# Altium project HEPA_CONTROL_PCB.PrjPcb
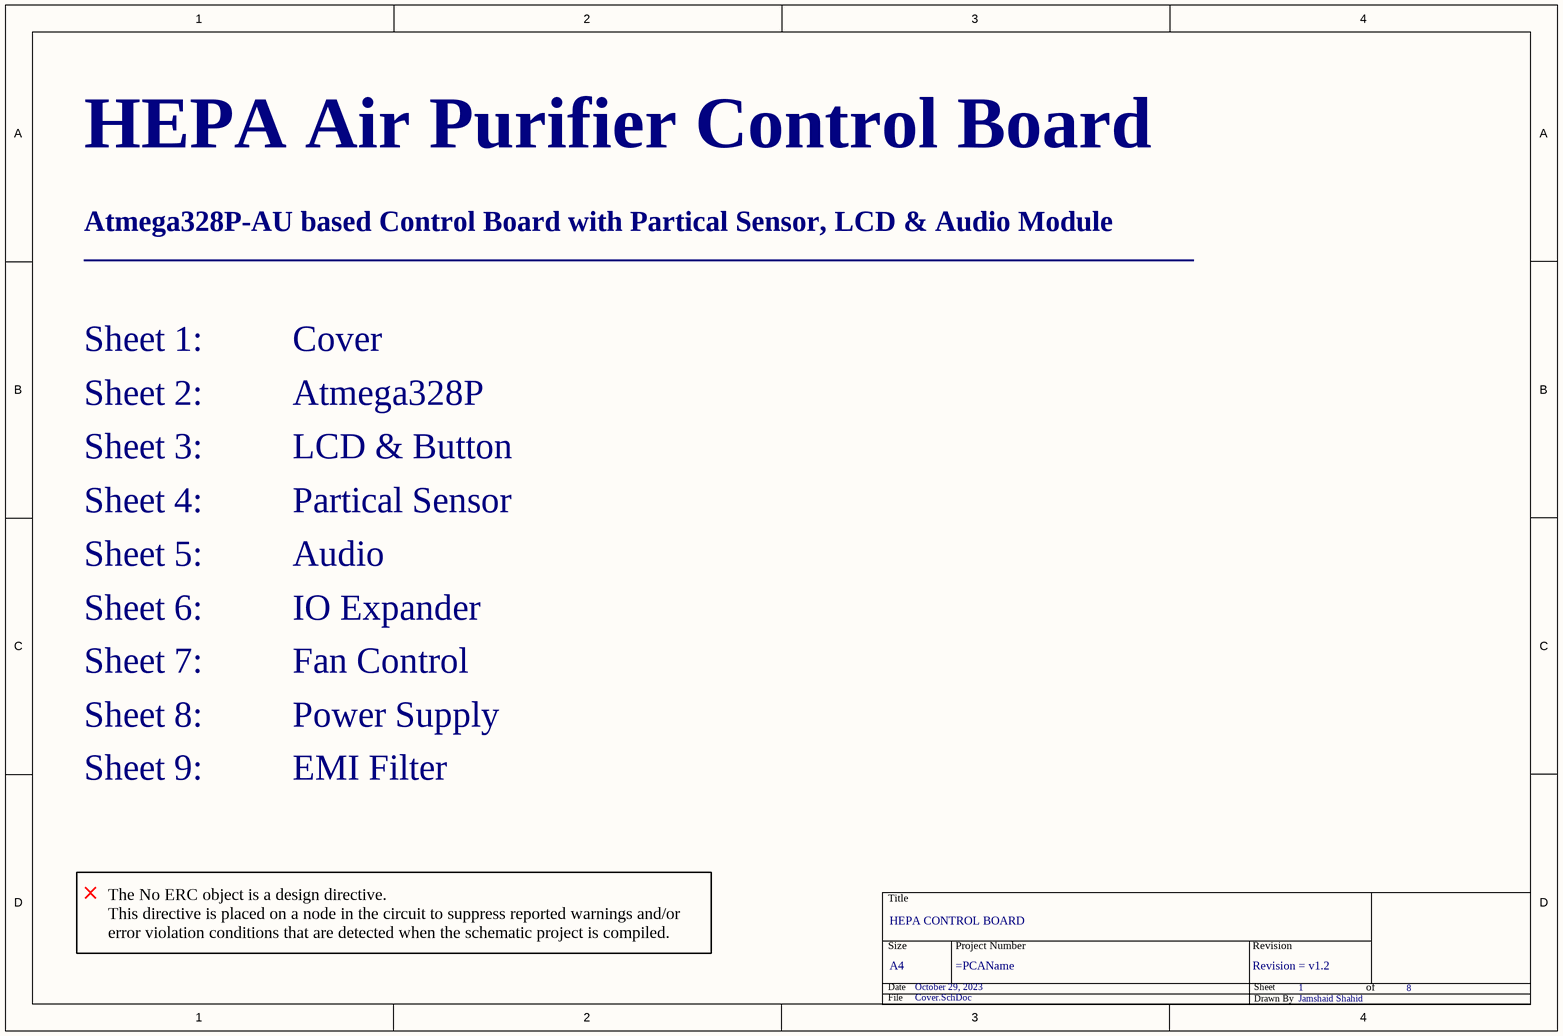
[diagram p0: Cover.SchDoc]
Date: October 29, 2023; DrawnBy: Jamshaid Shahid; revision: Revision = v1.2; Size: A4; Title: HEPA CONTROL BOARD
4 sheets, 38 parts. Net scope: flat (ports and power ports of the same name join across sheets).
Board file: HEPA_CONTROL_PCB.PcbDoc
Sheets:
  Cover.SchDoc
  Atmega328P.SchDoc
  IO_Expander.SchDoc
  POWER_SUPPLY.SchDoc

## Sheet Cover.SchDoc: HEPA CONTROL BOARD
size A4; SheetNumber: 1; SheetTotal: 8

### Parts
(Parts that share a designator on the sheet are numbered #1, #2 ... from top to bottom, then left to right.)
*#1  Title Block  (value not drawn)  (graphical)

### Notes on the sheet
- HEPA Air Purifier Control Board
- Atmega328P-AU based Control Board with Partical Sensor, LCD & Audio Module
- ____________________________________________________________
- Sheet 1:          Cover
- Sheet 2:          Atmega328P
- Sheet 4:          Partical Sensor
- Sheet 3:          LCD & Button
- Sheet 5:          Audio
- Sheet 6:          IO Expander
- Sheet 7:          Fan Control
- Sheet 8:          Power Supply
- Sheet 9:          EMI Filter
- The No ERC object is a design directive.
  This directive is placed on a node in the circuit to suppress reported warnings and/or error violation conditions that are detected when the schematic project is compiled.
- THIS DOCUMENT AND THE DATA DISCLOSED HEREIN OR
- HEREWITH IS THE PROPERTY OF ALTIUM LIMITED AND MAY
- DWG NO:
- REVISION
- REV:
- DESCRIPTION
- DATE
- APPROVED
- BE FREELY DISTRIBUTED IN WHOLE. NO RIGHTS ARE
- RESERVED OR EXPRESS OR IMPLIED WARANTEE GIVEN.
- ENG:
- APPROVALS
- PROJECT
- DSN:
- CHK:
- REFERENCE DOCUMENTS
- PROJECT REVISION:
- TITLE
- DOCUMENT REVISION:
- DESIGN ITEM:
- BOM:
- FAB DWG:
- PCB DWG:
- ASSY DWG:
- SCALE:
- A3
- SIZE
- CAGE CODE
- FILE NAME
- DWG NO.
- SHEET
- OF
- REV
- (in symbol Title Block) Title; Size; Project Number; Revision; Date; Sheet; of; File; Drawn By

## Sheet Atmega328P.SchDoc: HEPA CONTROL BOARD
size A4; SheetNumber: 2; SheetTotal: 8
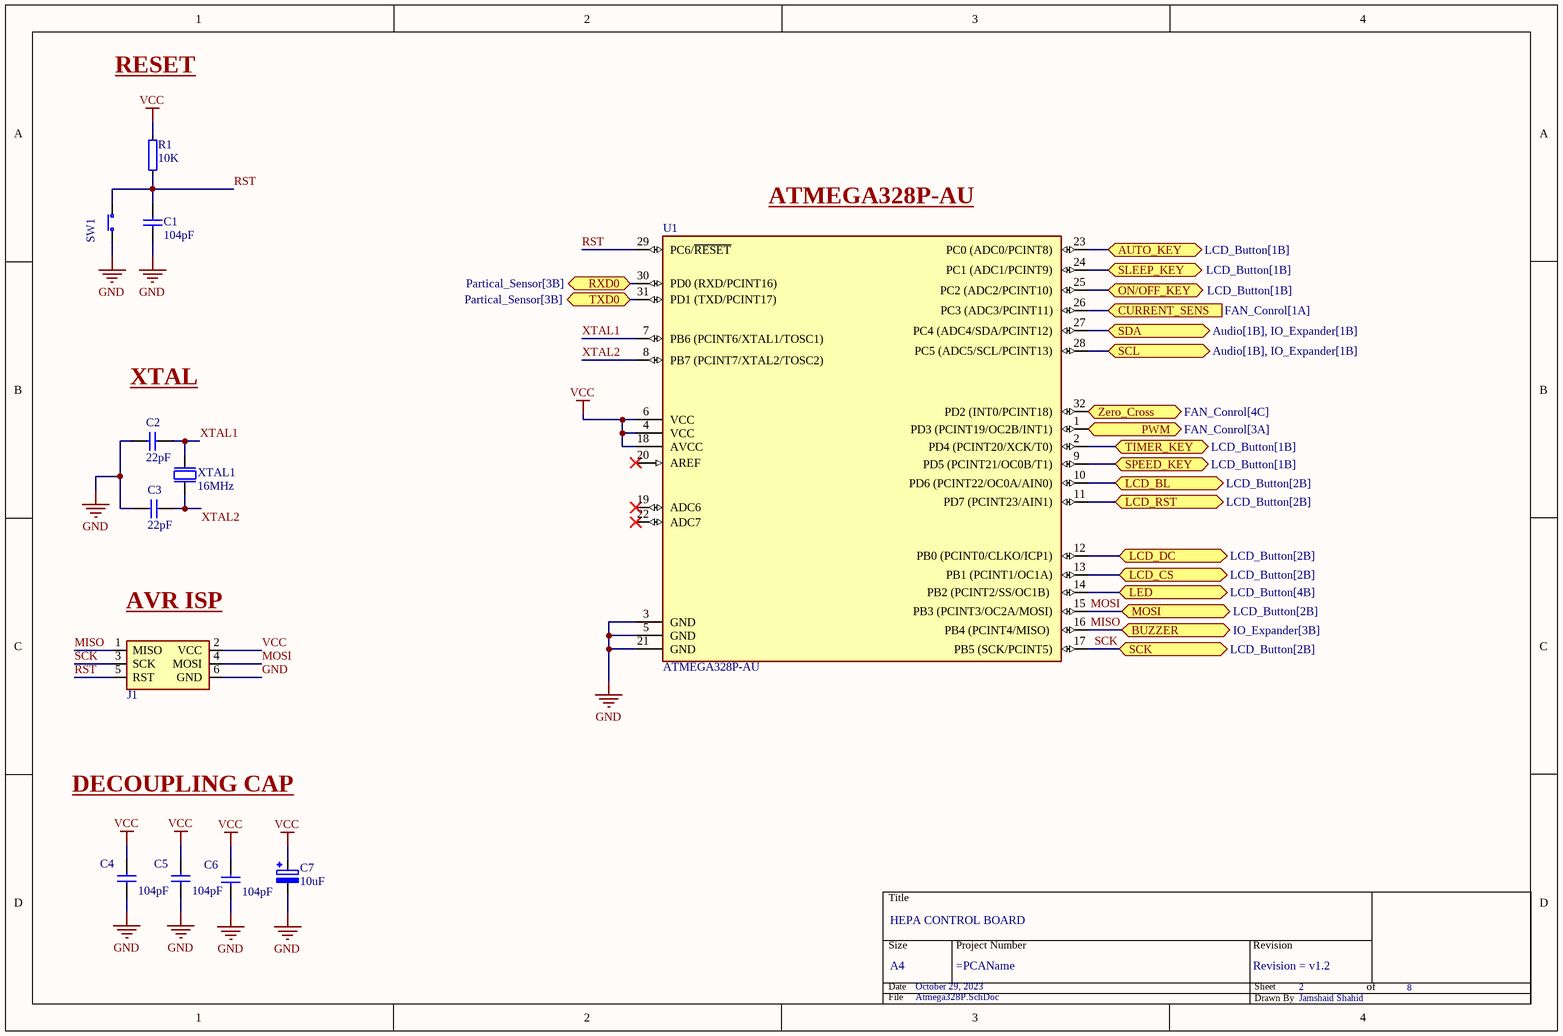
[diagram p1: Atmega328P.SchDoc]

### Parts
(Parts that share a designator on the sheet are numbered #1, #2 ... from top to bottom, then left to right.)
*#2  Title Block  (value not drawn)  (graphical)
C1  104pF  [CAPC2012X140N]
C2  22pF  [CAPC2012X140N]
C3  22pF  [CAPC2012X140N]
C4  104pF  [CAPC2012X140N]
C5  104pF  [CAPC2012X140N]
C6  104pF  [CAPC2012X140N]
C7  10uF  [CAPPRD250W50D630H1250]
J1  AVRISP Header  [AVRISP_Header]  (value not drawn)
R1  10K  [RESC2012X65N]
SW1  (no value)  [SW_TL1105F160Q]
U1  ATMEGA328P-AU  [QFP80P900X900X120-32N]
XTAL1  16MHz  [XTAL_ECS-160-20-16X]

### Ports
AUTO_KEY (bidir, see LCD_Button[1B]), BUZZER (bidir, see IO_Expander[3B]), CURRENT_SENS (in, see FAN_Conrol[1A]), LCD_BL (bidir, see LCD_Button[2B]), LCD_CS (bidir, see LCD_Button[2B]), LCD_DC (bidir, see LCD_Button[2B]), LCD_RST (bidir, see LCD_Button[2B]), LED (bidir, see LCD_Button[4B]), MOSI (bidir, see LCD_Button[2B]), ON/OFF_KEY (bidir, see LCD_Button[1B]), PWM (bidir, see FAN_Conrol[3A]), RXD0 (bidir, see Partical_Sensor[3B]), SCK (bidir, see LCD_Button[2B]), SCL (bidir, see Audio[1B], IO_Expander[1B]), SDA (bidir, see Audio[1B], IO_Expander[1B]), SLEEP_KEY (bidir, see LCD_Button[1B]), SPEED_KEY (bidir, see LCD_Button[1B]), TIMER_KEY (bidir, see LCD_Button[1B]), TXD0 (bidir, see Partical_Sensor[3B]), Zero_Cross (bidir, see FAN_Conrol[4C])

### Nets
GND: C1.1 C2.1 C3.1 C4.1 C5.1 C6.1 C7.2 J1.6(GND) SW1.2(COM) U1.3(GND) U1.5(GND) U1.21(GND)
VCC: C4.2 C5.2 C6.2 C7.1 J1.2(VCC) R1.2 U1.4(VCC) U1.6(VCC) U1.18(AVCC)
MISO: J1.1(MISO) U1.16(PB4_(PCINT4/MISO)) ; port BUZZER
MOSI: J1.4(MOSI) U1.15(PB3_(PCINT3/OC2A/MOSI)) ; port MOSI
RST: C1.2 J1.5(RST) R1.1 SW1.1(N.O) U1.29(PC6/~{RESET})
SCK: J1.3(SCK) U1.17(PB5_(SCK/PCINT5)) ; port SCK
XTAL1: C2.2 U1.7(PB6_(PCINT6/XTAL1/TOSC1)) XTAL1.2(out)
XTAL2: C3.2 U1.8(PB7_(PCINT7/XTAL2/TOSC2)) XTAL1.1(inp)
NetU1_1: U1.1(PD3_(PCINT19/OC2B/INT1)) ; port PWM
NetU1_2: U1.2(PD4_(PCINT20/XCK/T0)) ; port TIMER_KEY
NetU1_9: U1.9(PD5_(PCINT21/OC0B/T1)) ; port SPEED_KEY
NetU1_10: U1.10(PD6_(PCINT22/OC0A/AIN0)) ; port LCD_BL
NetU1_11: U1.11(PD7_(PCINT23/AIN1)) ; port LCD_RST
NetU1_12: U1.12(PB0_(PCINT0/CLKO/ICP1)) ; port LCD_DC
NetU1_13: U1.13(PB1_(PCINT1/OC1A)) ; port LCD_CS
NetU1_14: U1.14(PB2_(PCINT2/SS/OC1B)) ; port LED
NetU1_23: U1.23(PC0_(ADC0/PCINT8)) ; port AUTO_KEY
NetU1_24: U1.24(PC1_(ADC1/PCINT9)) ; port SLEEP_KEY
NetU1_25: U1.25(PC2_(ADC2/PCINT10)) ; port ON/OFF_KEY
NetU1_26: U1.26(PC3_(ADC3/PCINT11)) ; port CURRENT_SENS
NetU1_27: U1.27(PC4_(ADC4/SDA/PCINT12)) ; port SDA
NetU1_28: U1.28(PC5_(ADC5/SCL/PCINT13)) ; port SCL
NetU1_30: U1.30(PD0_(RXD/PCINT16)) ; port RXD0
NetU1_31: U1.31(PD1_(TXD/PCINT17)) ; port TXD0
NetU1_32: U1.32(PD2_(INT0/PCINT18)) ; port Zero_Cross

Not connected (* = marked no-connect by the designer): U1 19(ADC6)* 20(AREF)* 22(ADC7)*

### Notes on the sheet
- RESET
- (near U1) ATMEGA328P-AU
- XTAL
- (near J1) AVR ISP
- DECOUPLING CAP
- (in symbol Title Block) Title; Size; Project Number; Revision; Date; Sheet; of; File; Drawn By

### Library data of the parts
C1-C6 = CAP_0805: Part Number: CAP_0805; Pin Count: 2; Publisher: Metal Circuits
  C1 C4-C6: Value: 104pF
  C2 C3: Value: 22pF
C7 = Electrolytic Capacitor 6.3mm: Ø6.3 x 11mm LS=2.5mm Radial Aluminum Electrolytic Cap; Part Number: Cap Electrolytic; Manufacturer Part Number: Cap Electrolytic; Pin Count: 2; Publisher: Metal Circuits; Value: 10uF; FootPrint Doc: Radial
J1 = 67997-206HLF: AVR ISP Programming 2x3 Header male 2.54mm pith; Manufacturer: Amphenol ICC (FCI); Part Number: 67997-206HLF; Manufacturer Part Number: 67997-206HLF; Pin Count: 6; Publisher: Metal Circuits; Value: AVRISP Header
R1 = RES_0805: RES SMD 1% 1/10W 0805; Part Number: RES_0805; Pin Count: 2; Publisher: Metal Circuits; Value: 10K; FootPrint Doc: 0805
SW1 = SW-PB: Tactile Switch, SPNO, Through Hole; Part Number: SW-PB; Manufacturer Part Number: SW-PB; Pin Count: 4; Publisher: Metal Circuits
U1 = ATMEGA328P-AU: AVR AVR® ATmega Microcontroller IC 8-Bit 20MHz 32KB (16K x 16) FLASH 32-TQFP (7x7); Manufacturer: Microchip Technology; Part Number: ATMEGA328P-AU; Manufacturer Part Number: ATMEGA328P-AU; Pin Count: 32; Publisher: Metal Circuits; Value: ATMEGA328P-AU; FootPrint Doc: 32-TQFP; HelpURL: https://ww1.microchip.com/downloads/en/DeviceDoc/ATmega48A-PA-88A-PA-168A-PA-328-P-DS-DS40002061B.pdf; Supplier 1: Digi-Key; Supplier Part Number 1: ATMEGA328P-AU-ND
XTAL1 = ECS-40-20-4: 16 MHz ±30ppm Crystal 20pF 150 Ohms HC-49/US; Manufacturer: ECS Inc.; Part Number: ECS-40-20-4; Manufacturer Part Number: ECS-40-20-4; Pin Count: 2; Publisher: Metal Circuits; Value: 16MHz; FootPrint Doc: XTAL_ECS-160-20-16X

## Sheet IO_Expander.SchDoc: HEPA CONTROL BOARD
size A4; SheetNumber: 6; SheetTotal: 9
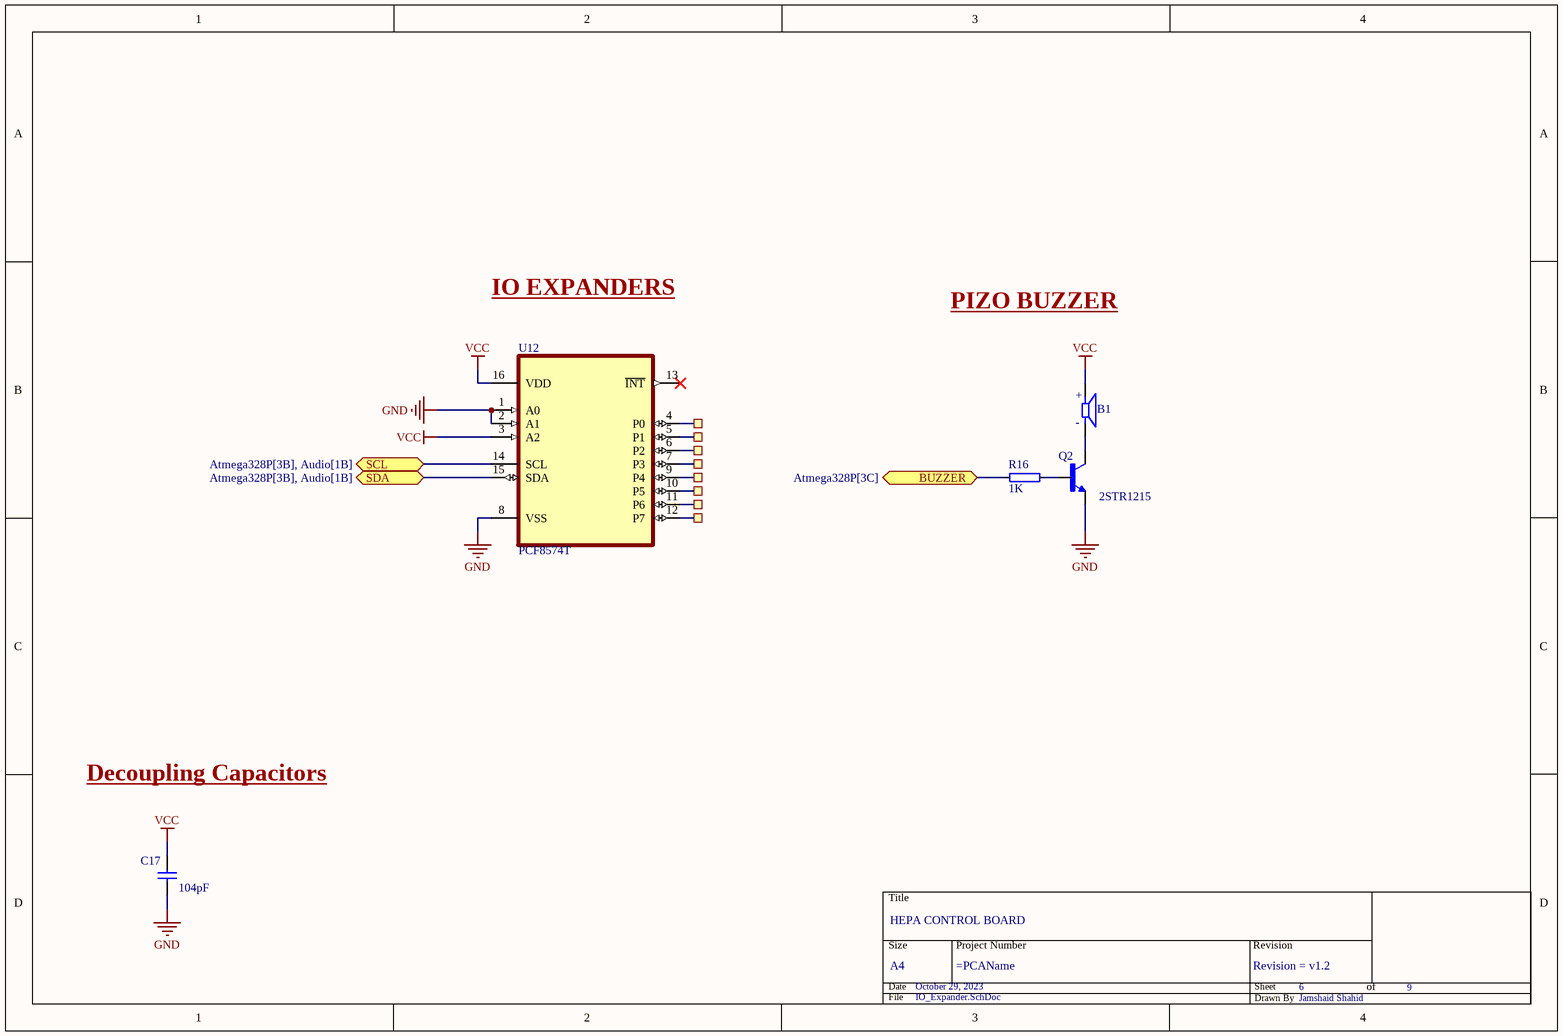
[diagram p2: IO_Expander.SchDoc]

### Parts
(Parts that share a designator on the sheet are numbered #1, #2 ... from top to bottom, then left to right.)
*#3  Title Block  (value not drawn)  (graphical)
B1  CST-951AP  [CUI_CST-951AP]  (value not drawn)
C17  104pF  [CAPC2012X140N]
Q2  2STR1215  [SOT95P280X125-3N]
R16  1K  [RESC2012X65N]
TP3  TP  [TESTPAD-TH]  (value not drawn)  (no BOM)
TP4  TP  [TESTPAD-TH]  (value not drawn)  (no BOM)
TP5  TP  [TESTPAD-TH]  (value not drawn)  (no BOM)
TP6  TP  [TESTPAD-TH]  (value not drawn)  (no BOM)
TP7  TP  [TESTPAD-TH]  (value not drawn)  (no BOM)
TP8  TP  [TESTPAD-TH]  (value not drawn)  (no BOM)
TP9  TP  [TESTPAD-TH]  (value not drawn)  (no BOM)
TP10  TP  [TESTPAD-TH]  (value not drawn)  (no BOM)
U12  PCF8574T  [SOIC127P1032X265-16N]

### Ports
BUZZER (bidir, see Atmega328P[3C]), SCL (bidir, see Atmega328P[3B], Audio[1B]), SDA (bidir, see Atmega328P[3B], Audio[1B])

### Nets
GND: C17.1 Q2.2(E) U12.1(A0) U12.2(A1) U12.8(VSS)
VCC: B1.P C17.2 U12.3(A2) U12.16(VDD)
MISO: R16.2 ; port BUZZER
NetB1_M: B1.M Q2.3(C)
NetQ2_1: Q2.1(B) R16.1
NetTP3_1: TP3.1 U12.4(P0)
NetTP4_1: TP4.1 U12.5(P1)
NetTP5_1: TP5.1 U12.6(P2)
NetTP6_1: TP6.1 U12.7(P3)
NetTP7_1: TP7.1 U12.9(P4)
NetTP8_1: TP8.1 U12.10(P5)
NetTP9_1: TP9.1 U12.11(P6)
NetTP10_1: TP10.1 U12.12(P7)
NetU1_27: U12.15(SDA) ; port SDA
NetU1_28: U12.14(SCL) ; port SCL

Not connected (* = marked no-connect by the designer): U12 13(~{INT})*

### Notes on the sheet
- IO EXPANDERS
- PIZO BUZZER
- Decoupling Capacitors
- (in symbol CST-951AP) +; -
- (in symbol Title Block) Title; Size; Project Number; Revision; Date; Sheet; of; File; Drawn By

### Library data of the parts
B1 = CST-951AP: 9 mm, 5 V, 85 dB, Through Hole, Magnetic Audio Transducer B; Part Number: CST-951AP; Manufacturer Part Number: CST-951AP; Pin Count: 2; Publisher: Metal Circuits; Value: CST-951AP
C17 = CAP_0805: Part Number: CAP_0805; Pin Count: 2; Publisher: Metal Circuits; Value: 104pF
Q2 = 2STR1215: Bipolar (BJT) Transistor NPN 15 V 1.5 A - 500 mW Surface Mount SOT-23-3; Manufacturer: ST; Part Number: 2STR1215; Manufacturer Part Number: 2STR1215; Pin Count: 3; Publisher: Metal Circuits; Value: 2STR1215; FootPrint Doc: SOT-23
R16 = RES_0805: RES SMD 1% 1/10W 0805; Part Number: RES_0805; Pin Count: 2; Publisher: Metal Circuits; Value: 1K; FootPrint Doc: 0805
TP3-TP10 = TESTPAD_TH: Testpoint, through hole; Part Number: Testpoint TH; Artikkelnr Noca: N.A.; Manufacturer: *; Manufacturer Part Number: *; Datasheet: *; Footprint Doc: TESTPAD-TH; LatestRevisionDate: 2009-12-12; Pin Count: 1; Publisher: Nordic Semiconductor; Published: 2009-12-12; Value: TP; Note: *; Supplier: *; Supplier part number: *; 2nd source Supplier: *; 2nd source part number: *; Artikkelnr Simpro: N.A.
U12 = PCF8574T/3,518: IC XPNDR 100KHZ I2C 16SO; Manufacturer: NXP; Part Number: PCF8574T/3,518; Manufacturer Part Number: PCF8574T/3,518; Pin Count: 16; Publisher: Metal Circuits; Value: PCF8574T; FootPrint Doc: SOIC-16

## Sheet POWER_SUPPLY.SchDoc: HEPA CONTROL BOARD
size A4; SheetNumber: 8; SheetTotal: 9
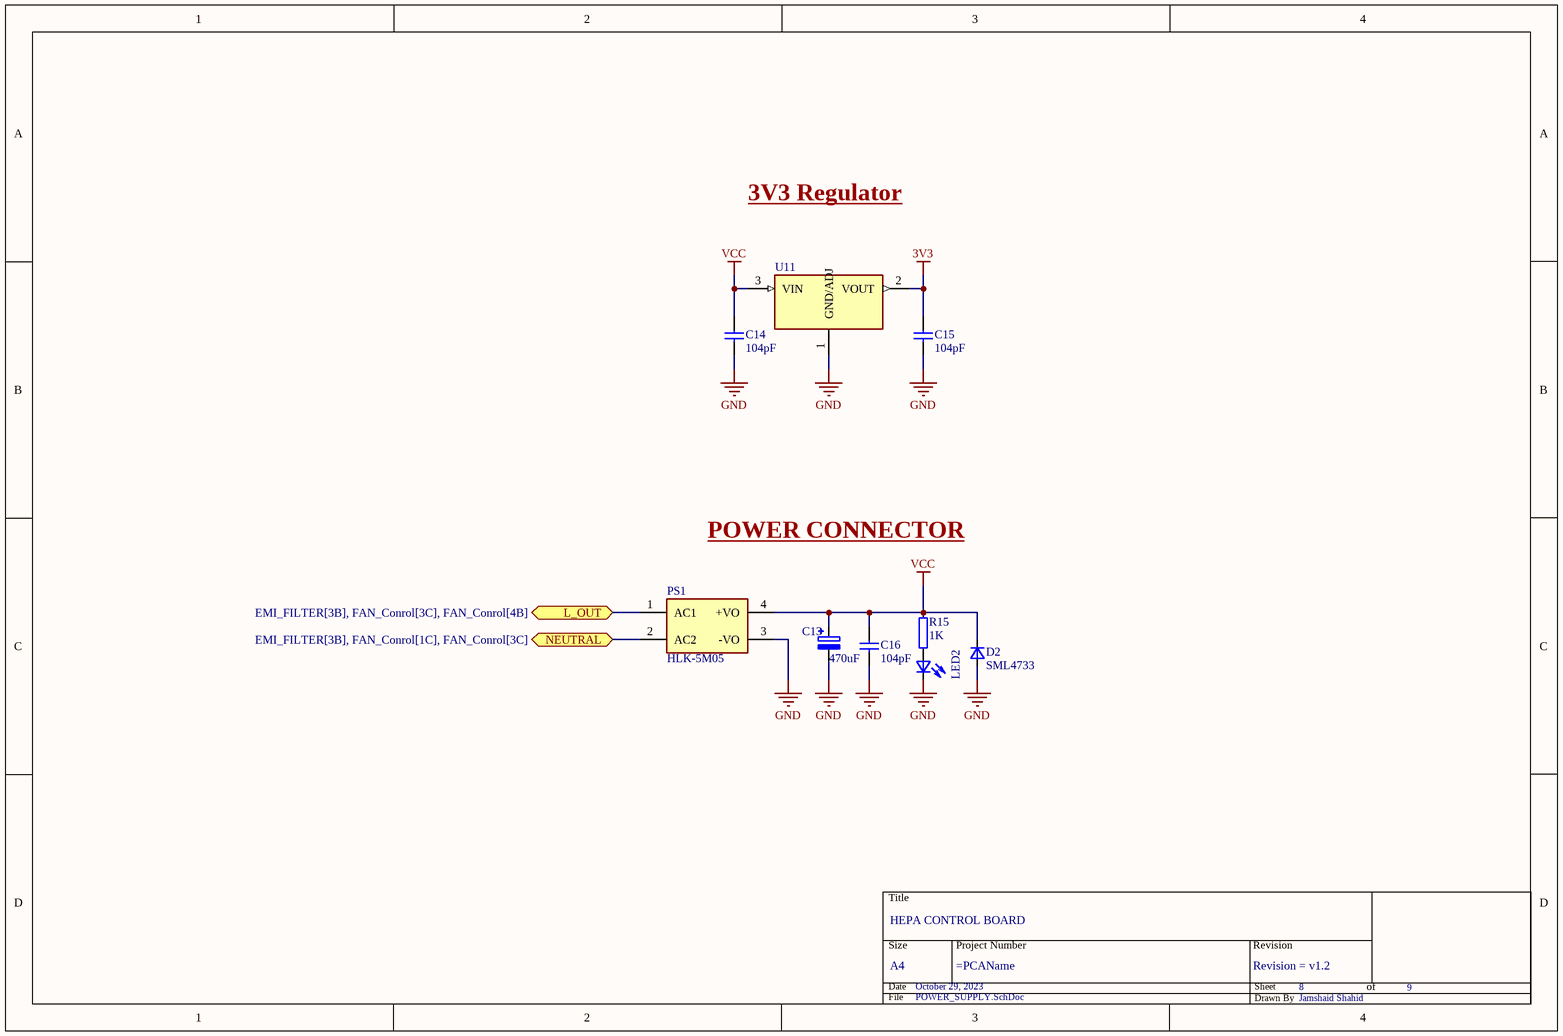
[diagram p3: POWER_SUPPLY.SchDoc]

### Parts
(Parts that share a designator on the sheet are numbered #1, #2 ... from top to bottom, then left to right.)
*#4  Title Block  (value not drawn)  (graphical)
C13  470uF  [CAPPRD500W60D1000H1300]
C14  104pF  [CAPC2012X140N]
C15  104pF  [CAPC2012X140N]
C16  104pF  [CAPC2012X140N]
D2  SML4733  [DO-214AC]
LED2  LED_0603  [LED_KP-2012]  (value not drawn)
PS1  HLK-5M05  [CONV_HLK-5M05]
R15  1K  [RESC2012X65N]
U11  AMS1117-3.3  [SOT229P700X180-4N]  (value not drawn)

### Ports
L_OUT (bidir, see EMI_FILTER[3B], FAN_Conrol[3C], FAN_Conrol[4B]), NEUTRAL (bidir, see EMI_FILTER[3B], FAN_Conrol[1C], FAN_Conrol[3C])

### Nets
3V3: C15.2 U11.2(VOUT)
GND: C13.2 C14.1 C15.1 C16.1 D2.1(ANNODE) LED2.2(Cathode) PS1.3(-VO) U11.1(GND/ADJ)
VCC: C13.1 C14.2 C16.2 D2.2(CATHODE) PS1.4(+VO) R15.2 U11.3(VIN)
NetLED2_1: LED2.1(Anode) R15.1
NetPS1_1: PS1.1(AC1) ; port L_OUT
NetPS1_2: PS1.2(AC2) ; port NEUTRAL

### Notes on the sheet
- 3V3 Regulator
- POWER CONNECTOR
- (in symbol Title Block) Title; Size; Project Number; Revision; Date; Sheet; of; File; Drawn By

### Library data of the parts
C13 = Electrolytic Capacitor: Aluminum Electrolytic Capacitors - Radial Leaded; Part Number: Cap Electrolytic; Manufacturer Part Number: Cap Electrolytic; Pin Count: 2; Publisher: Metal Circuits; Value: 470uF; FootPrint Doc: Radial-2
C14-C16 = CAP_0805: Part Number: CAP_0805; Pin Count: 2; Publisher: Metal Circuits; Value: 104pF
D2 = SML4733: Zener Diode Single 5.1V 10% 7Ohm 1000mW 2-Pin SMA; Part Number: SML4733; Manufacturer Part Number: SML4733; Pin Count: 2; Publisher: Metal Circuits; Value: SML4733; FootPrint Doc: DO-214AC
LED2 = LED_0603: LED SMD 0603; Part Number: LED_0603; Manufacturer Part Number: LED_0603; Pin Count: 2; Publisher: Metal Circuits; Value: LED_0603
PS1 = HLK-5M05: 5V 1A 90VAC~265VAC 120V~350V 5W AC-DC 69% Plugin Power Modules ROHS; Manufacturer: HI-LINK; Part Number: HLK-5M05; Manufacturer Part Number: HLK-5M05; Pin Count: 4; Publisher: Metal Circuits; Value: HLK-5M05
R15 = RES_0805: RES SMD 1% 1/10W 0805; Part Number: RES_0805; Pin Count: 2; Publisher: Metal Circuits; Value: 1K; FootPrint Doc: 0805
U11 = AMS1117-3.3: Sot223/Pkg 1-Amp 3.3-Volt Low Drop Out Voltage Regulatator; Manufacturer: AMS; Part Number: AMS1117-3.3; Manufacturer Part Number: AMS1117-3.3; Pin Count: 4; Publisher: Metal Circuits; Value: AMS1117-3.3; FootPrint Doc: SOT-223

## Nets that join several sheets
GND: Atmega328P (12 pins), IO_Expander (5 pins), POWER_SUPPLY (8 pins)
VCC: Atmega328P (9 pins), IO_Expander (B1.P C17.2 U12.3 U12.16), POWER_SUPPLY (7 pins)
MISO: Atmega328P (J1.1 U1.16), IO_Expander (R16.2)
NetU1_27: Atmega328P (U1.27), IO_Expander (U12.15)
NetU1_28: Atmega328P (U1.28), IO_Expander (U12.14)